# Altium schematic sheet EtherWiz_3K4KNic.SchDoc
size A3; SheetNumber: 2; SheetTotal: 3
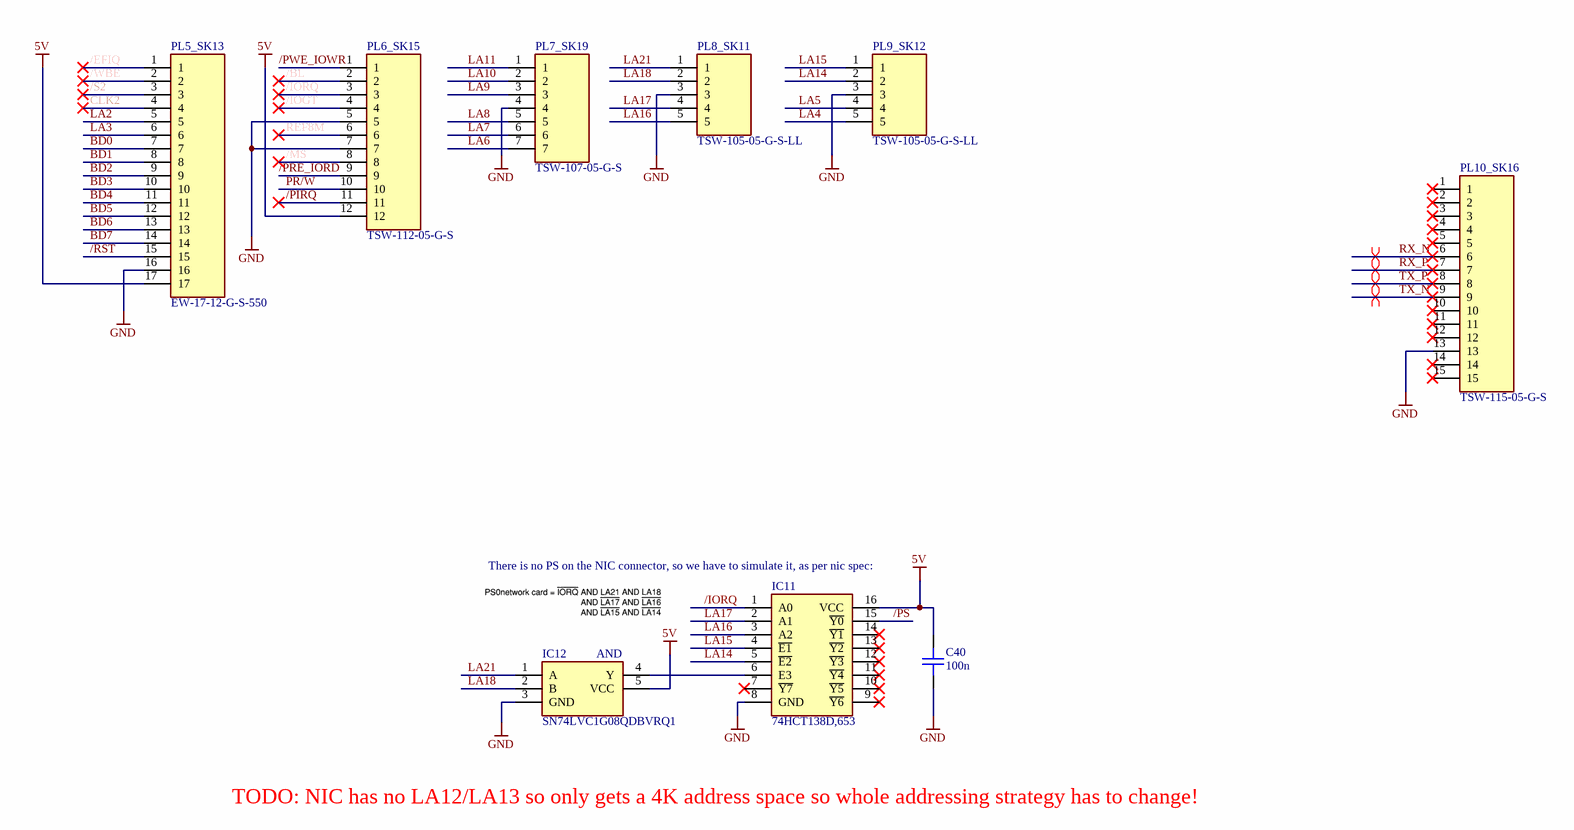
[diagram p0: EtherWiz_3K4KNic.SchDoc]

## Parts
C40  100n  [CAPC1608L]
IC11  74HCT138D,653  [SOIC127P600X175-16N]
IC12  SN74LVC1G08QDBVRQ1  [SOT95P280X145-5N]
PL5_SK13  EW-17-12-G-S-550  [TSW-117-XX-YY-S]
PL6_SK15  TSW-112-05-G-S  [TSW-112-XX-YY-S]
PL7_SK19  TSW-107-05-G-S  [TSW-107-XX-YY-S]
PL8_SK11  TSW-105-05-G-S-LL  [HDRV5W64P0X254_1X5_1270X254X521P]
PL9_SK12  TSW-105-05-G-S-LL  [HDRV5W64P0X254_1X5_1270X254X521P]
PL10_SK16  TSW-115-05-G-S  [TSW-115-XX-YY-S]

## Nets
5V: C40.2 IC11.16(VCC) IC12.5(VCC) PL5_SK13.17 PL6_SK15.12
GND: C40.1 IC11.8(GND) IC12.3(GND) PL5_SK13.16 PL6_SK15.5 PL6_SK15.7 PL7_SK19.4 PL8_SK11.3 PL9_SK12.3 PL10_SK16.13
/BL: PL6_SK15.2
/EFIQ: PL5_SK13.1
/IOGT: PL6_SK15.4
/IORQ: IC11.1(A0) PL6_SK15.3
/MS: PL6_SK15.8
/PIRQ: PL6_SK15.11
/PRE_IORD: PL6_SK15.9
/PS: IC11.15(~{Y0})
/PWE_IOWR: PL6_SK15.1
/RST: PL5_SK13.15
/S2: PL5_SK13.3
/WBE: PL5_SK13.2
BD0: PL5_SK13.7
BD1: PL5_SK13.8
BD2: PL5_SK13.9
BD3: PL5_SK13.10
BD4: PL5_SK13.11
BD5: PL5_SK13.12
BD6: PL5_SK13.13
BD7: PL5_SK13.14
CLK2: PL5_SK13.4
LA2: PL5_SK13.5
LA3: PL5_SK13.6
LA4: PL9_SK12.5
LA5: PL9_SK12.4
LA6: PL7_SK19.7
LA7: PL7_SK19.6
LA8: PL7_SK19.5
LA9: PL7_SK19.3
LA10: PL7_SK19.2
LA11: PL7_SK19.1
LA14: IC11.5(~{E2}) PL9_SK12.2
LA15: IC11.4(~{E1}) PL9_SK12.1
LA16: IC11.3(A2) PL8_SK11.5
LA17: IC11.2(A1) PL8_SK11.4
LA18: IC12.2(B) PL8_SK11.2
LA21: IC12.1(A) PL8_SK11.1
PR/W: PL6_SK15.10
REF8M: PL6_SK15.6
RX_N: PL10_SK16.6
RX_P: PL10_SK16.7
TX_N: PL10_SK16.9
TX_P: PL10_SK16.8
NetIC11_6: IC11.6(E3) IC12.4(Y)

Not connected (* = marked no-connect by the designer): IC11 7(~{Y7})* 9(~{Y6})* 10(~{Y5})* 11(~{Y4})* 12(~{Y3})* 13(~{Y2})* 14(~{Y1})*; PL10_SK16 1* 2* 3* 4* 5* 10* 11* 12* 14* 15*

## Layout directives
differential pair: RX_N, RX_P, TX_N, TX_P

## Notes on the sheet
- (near IC11) There is no PS on the NIC connector, so we have to simulate it, as per nic spec:
- (near IC12) AND
- TODO: NIC has no LA12/LA13 so only gets a 4K address space so whole addressing strategy has to change!
- SIZE
- DIMENSIONS
- TITLE
- VARIANT
- REVISION
- DATE
- A3
- SHEET
- OF
- FILE
- DRAWN BY

## Library data of the parts
C40 = CAP_100n_0603_50V_0: CAP 100nF, 0603, 50V, X7R, 10%; Manufacturer1: Samsung; ManuPart1: CL10B104KB8NNNC; ManuPart2: CC0603KRX7R9BB104; Value: 100n; Distributor1: Anglia; Manufacturer2: Yageo; Distributor2: Digikey; Distributor1 Part No: CL10B104KB8NNNC; Distributor2 Part No: 311-1344-2-ND; ComponentLinknURL: *; ComponentLink1Description: ComponentLinknURL1; ComponentLink1URL: https://media.digikey.com/pdf/Data%20Sheets/Samsung%20PDFs/CL_Series_MLCC_ds.pdf; ComponentLink2Description: ComponentLinknURL2; ComponentLink2URL: https://www.yageo.com/upload/media/product/productsearch/datasheet/mlcc/UPY-GPHC_X7R_6.3V-to-50V_18.pdf; Voltage: 50V
IC11 = 74HCT138D,653: Integrated Circuit; Manufacturer_Name: Nexperia; Datasheet Link: https://assets.nexperia.com/documents/data-sheet/74HC_HCT138.pdf; Height: 1.75mm; Manufacturer_Part_Number: 74HCT138D,653; Mouser Part Number: 771-74HCT138D-T; Mouser Price/Stock: https://www.mouser.co.uk/ProductDetail/Nexperia/74HCT138D653?qs=P62ublwmbi8MKahyK7iY6g%3D%3D; Arrow Part Number: 74HCT138D,653; Arrow Price/Stock: https://www.arrow.com/en/products/74hct138d653/nexperia?region=nac
IC12 = SN74LVC1G08QDBVRQ1: Integrated Circuit; Manufacturer_Name: Texas Instruments; Datasheet Link: http://www.ti.com/lit/ds/symlink/sn74lvc1g08-q1.pdf; Height: 1.45mm; Manufacturer_Part_Number: SN74LVC1G08QDBVRQ1; Mouser Part Number: 595-SN74LVC1G08QDBQ1; Mouser Price/Stock: https://www.mouser.co.uk/ProductDetail/Texas-Instruments/SN74LVC1G08QDBVRQ1?qs=PVVDbbWpW3K%252BPBrUmLG6eg%3D%3D; Arrow Part Number: SN74LVC1G08QDBVRQ1; Arrow Price/Stock: https://www.arrow.com/en/products/sn74lvc1g08qdbvrq1/texas-instruments?utm_currency=USD&region=nac
PL5_SK13 = TSW-117-05-G-S: Connector; Manufacturer_Name: SAMTEC; Datasheet Link: http://suddendocs.samtec.com/prints/tsw-xxx-xx-xxx-x-xx-xxx-mkt.pdf; Manufacturer_Part_Number: TSW-117-05-G-S
PL6_SK15 = TSW-112-05-G-S: Connector; Manufacturer_Name: SAMTEC; Datasheet Link: http://suddendocs.samtec.com/prints/tsw-xxx-xx-xxx-x-xx-xxx-mkt.pdf; Manufacturer_Part_Number: TSW-112-05-G-S
PL7_SK19 = TSW-107-05-G-S: Connector; Manufacturer_Name: SAMTEC; Datasheet Link: http://suddendocs.samtec.com/prints/tsw-xxx-xx-xxx-x-xx-xxx-mkt.pdf; Manufacturer_Part_Number: TSW-107-05-G-S
PL8_SK11 PL9_SK12 = TSW-105-05-G-S-LL: Connector; Manufacturer_Name: SAMTEC; Datasheet Link: https://componentsearchengine.com/Datasheets/2/TSW-105-05-G-S-LL.pdf; Height: 5.21mm; Manufacturer_Part_Number: TSW-105-05-G-S-LL
PL10_SK16 = TSW-115-05-G-S: Connector; Manufacturer_Name: SAMTEC; Datasheet Link: http://suddendocs.samtec.com/prints/tsw-xxx-xx-xxx-x-xx-xxx-mkt.pdf; Manufacturer_Part_Number: TSW-115-05-G-S